# EAGLE design Front PCB (EAGLE 7.4.0)
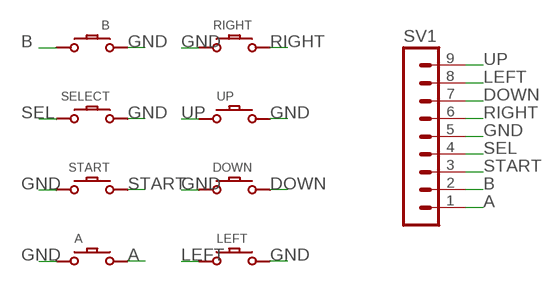
[diagram p0: schematic, sheet 1]

## Parts
A  DMG-BTN  DMG-BTNREGULAR  [DMG-BTN]
B  DMG-BTN  DMG-BTNREGULAR  [DMG-BTN]
DOWN  DMG-BTN  DMG-BTNREGULAR  [DMG-BTN]
LEFT  DMG-BTN  DMG-BTNREGULAR  [DMG-BTN]
RIGHT  DMG-BTN  DMG-BTNREGULAR  [DMG-BTN]
SELECT  DMG-BTN  DMG-BTNSELECT  [DMG-SEL]
START  DMG-BTN  DMG-BTNSTART  [DMG-ST]
SV1  MA09-1  [MA09-1]
UP  DMG-BTN  DMG-BTNREGULAR  [DMG-BTN]

## Nets
A: A.P$2 SV1.1
B: B.P$2 SV1.2
DOWN: DOWN.P$1 SV1.7
GND: A.P$1 B.P$1 DOWN.P$2 LEFT.P$2 RIGHT.P$2 SELECT.P$1 START.P$2 SV1.5 UP.P$2
LEFT: LEFT.P$1 SV1.8
RIGHT: RIGHT.P$1 SV1.6
SEL: SELECT.P$2 SV1.4
START: START.P$1 SV1.3
UP: SV1.9 UP.P$1

## Library data of the parts
A B DOWN LEFT RIGHT SELECT START UP = Game Boy:DMG-BTN
SV1 = con-lstb:MA09-1: PIN HEADER; OC_FARNELL: unknown; OC_NEWARK: unknown

## Board
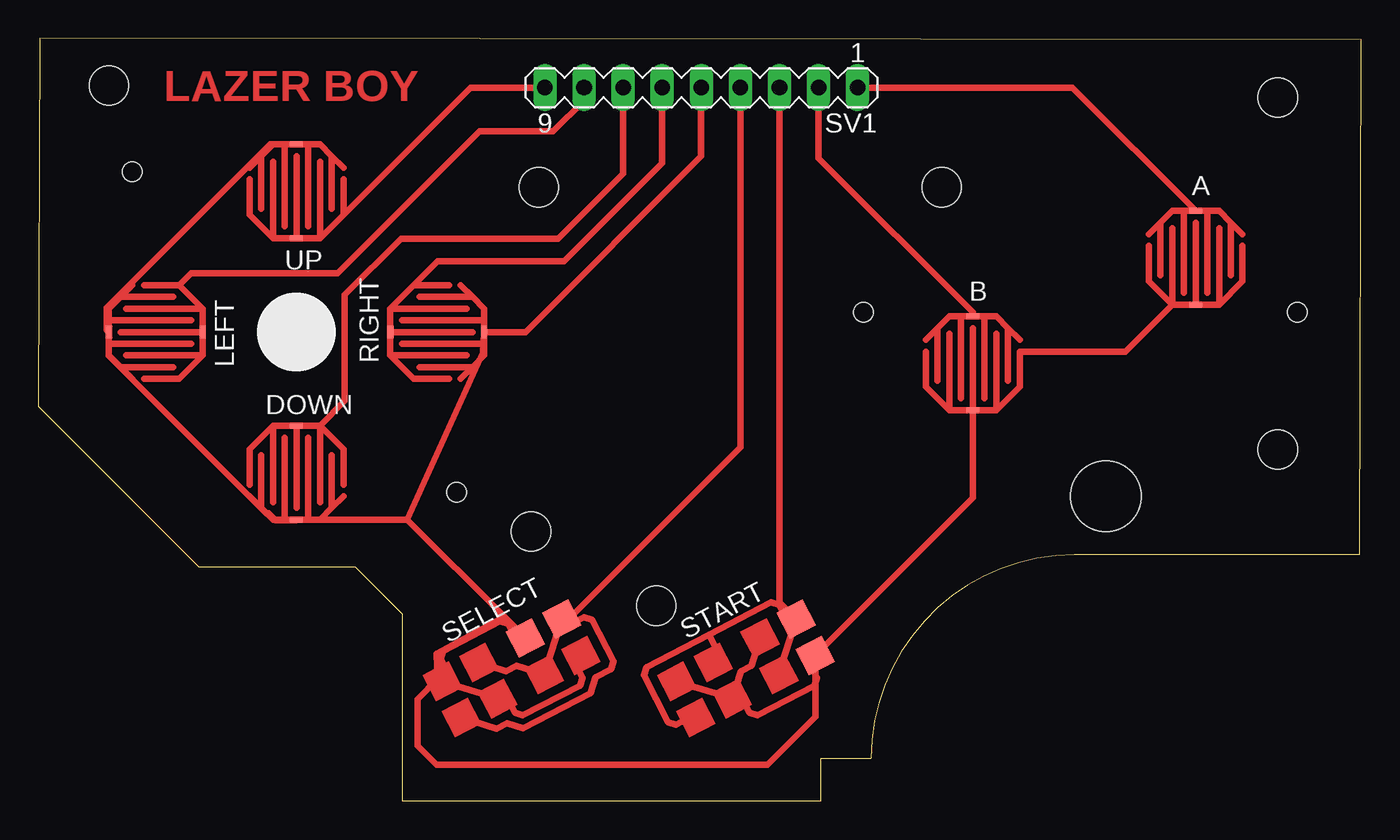
[diagram p1: board, top side]
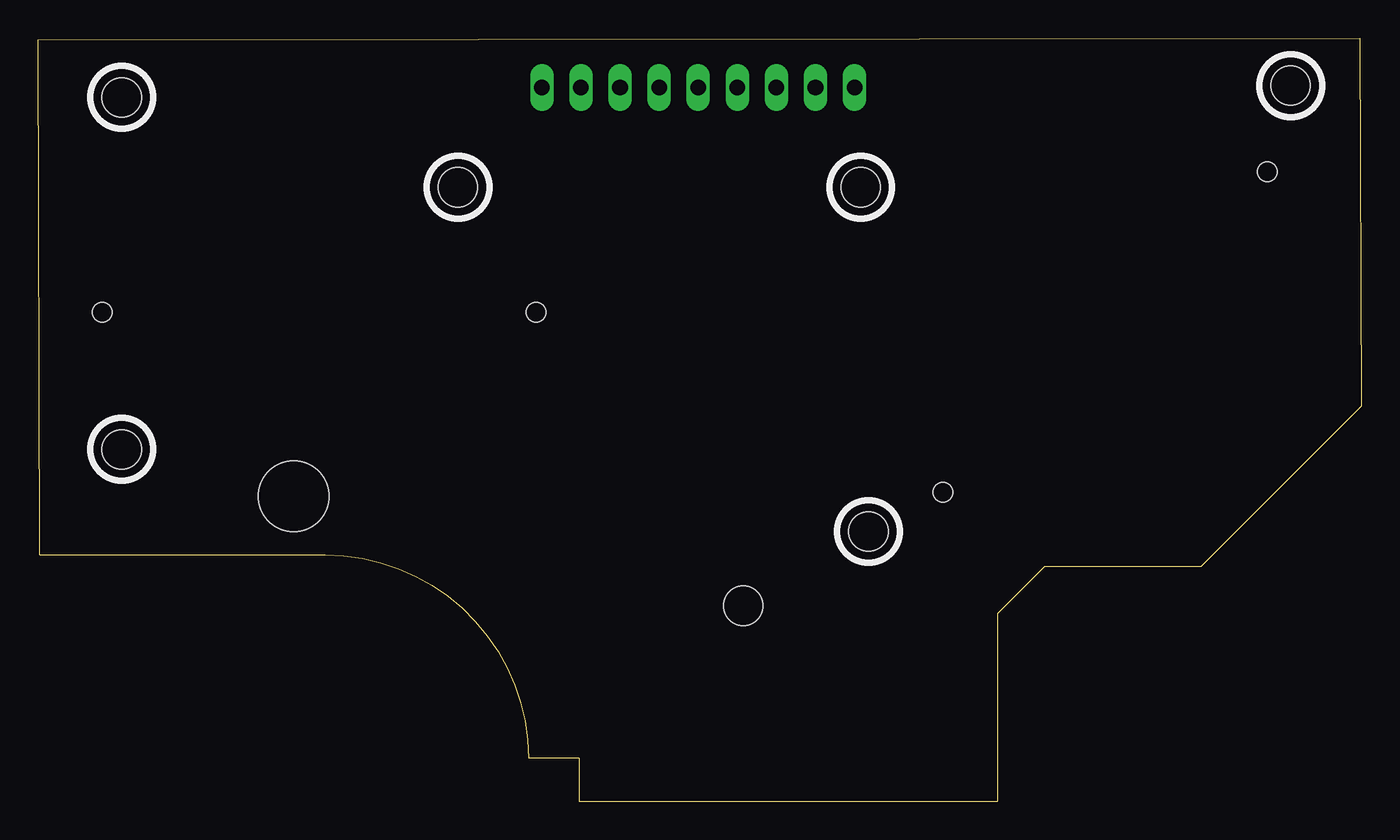
[diagram p2: board, bottom side, seen from below]

Size 85.93 x 49.54 mm. Coordinates in mm from the lower left corner, seen from the top.
Outline: 0,25.65 10.41,15.24 20.57,15.24 23.62,12.19 23.62,0 50.8,0 50.8,2.79 54.1,2.79 arc-90 67.31,16 85.85,16 85.93,49.47 0.08,49.54 0,25.65
Copper layers (1*16): Top 0.035mm / dielectric 1.5mm / Bottom 0.035mm
Design rules "fab": minimum track width 0.3mm, minimum drill 32mil, track to track 0.397mm, track to pad 0.397mm, pad to pad 0.397mm, via to via 0.397mm, smd to smd 0.315mm, copper to edge 40mil, drill to drill 16mil, minimum pad ring 10mil, minimum via ring 8mil, stop-mask expansion 4mil, vias tented up to drill 0mil, thermal gap 10mil
Holes 4.57 mm at 69.34,19.81
Holes 2.54 mm at 4.57,46.48 80.52,45.72 80.52,22.86 32.51,39.88 58.67,39.88 32,17.53 40.13,12.7
Holes 1.27 mm at 53.59,31.75 27.18,20.07 81.79,31.75 6.1,40.89

### Footprints (pad centres in the part's own frame; a part is rotated, then mirrored left to right if it is on the bottom)
DMG-BTN = smd 0.813 x 0.406: P$1 0,-3.048; P$2 0,3.048
DMG-SEL = smd 1.905 x 1.905: P$1 1.714,1.333; P$2 4.381,1.333
DMG-ST = smd 1.905 x 1.905: P$1 4.381,1.333; P$2 4.381,-1.333
MA09-1 = drill 1.016 long: 1 -10.16,0; 2 -7.62,0; 3 -5.08,0; 4 -2.54,0; 5 0,0; 6 2.54,0; 7 5.08,0; 8 7.62,0; 9 10.16,0

### Placement (x,y rotation side)
A  75.18,35.31 0 top
B  60.71,28.45 0 top
DOWN  16.76,21.34 180 top
LEFT  7.62,30.48 90 top
RIGHT  25.91,30.48 270 top
SELECT  30.73,8.64 27.5 top
START  45.97,8.64 27.5 top
SV1  43.07,46.36 180 top
UP  16.76,39.62 0 top

### Tracks (layer width: path | path; a pad name or v marks a point on that pad's centre or on a via)
A
  Top 0.406: A.P$2 67.18,46.36 SV1.1
B
  Top 0.406: B.P$2 60.71,31.75 50.69,41.77 SV1.2
DOWN
  Top 0.406: SV1.7 37.99,40.77 33.76,36.54 23.55,36.54 19.91,32.9 19.91,26 18.29,24.38
GND
  Top 0.406: UP.P$2 15.06,42.67 4.43,32.05 4.43,30.62 LEFT.P$2 4.57,28.95 14.8,18.72 14.95,18.72 15.42,18.25 16.73,18.25 DOWN.P$2 23.96,18.29 | 23.96,18.29 30.27,11.97 | 30.27,11.97 SELECT.P$1 | 25.94,7.95 24.62,6.63 24.62,3.61 25.86,2.37 47.37,2.37 50.48,5.48 START.P$2 60.71,19.71 B.P$1 | 25.94,7.95 26.25,7.95 | 30.27,11.97 25.86,9.58 25.94,7.95 | 23.96,18.29 28.88,29.18 RIGHT.P$2 31.64,30.48 43.04,41.89 43.04,46.33 SV1.5 | 63.75,29.21 70.61,29.21 73.66,32.26
LEFT
  Top 0.406: SV1.8 35.45,45.51 33.45,43.51 28.66,43.51 19.44,34.29 9.91,34.29 9.14,33.53
RIGHT
  Top 0.406: SV1.6 40.53,41.45 34.14,35.07 25.92,35.07 24.38,33.53
SEL
  Top 0.406: SELECT.P$2 34.46,11.84 45.61,22.98 SV1.4
START
  Top 0.406: START.P$1 48.15,12.94 SV1.3
UP
  Top 0.406: SV1.9 28.07,46.36 19.81,38.1
(copper drawn outside any net)
  shapes: Top circle x1

### Text on the board
Top: LAZER BOY